# EAGLE design scale-slave (EAGLE 9.1.0)
DELETE: MF
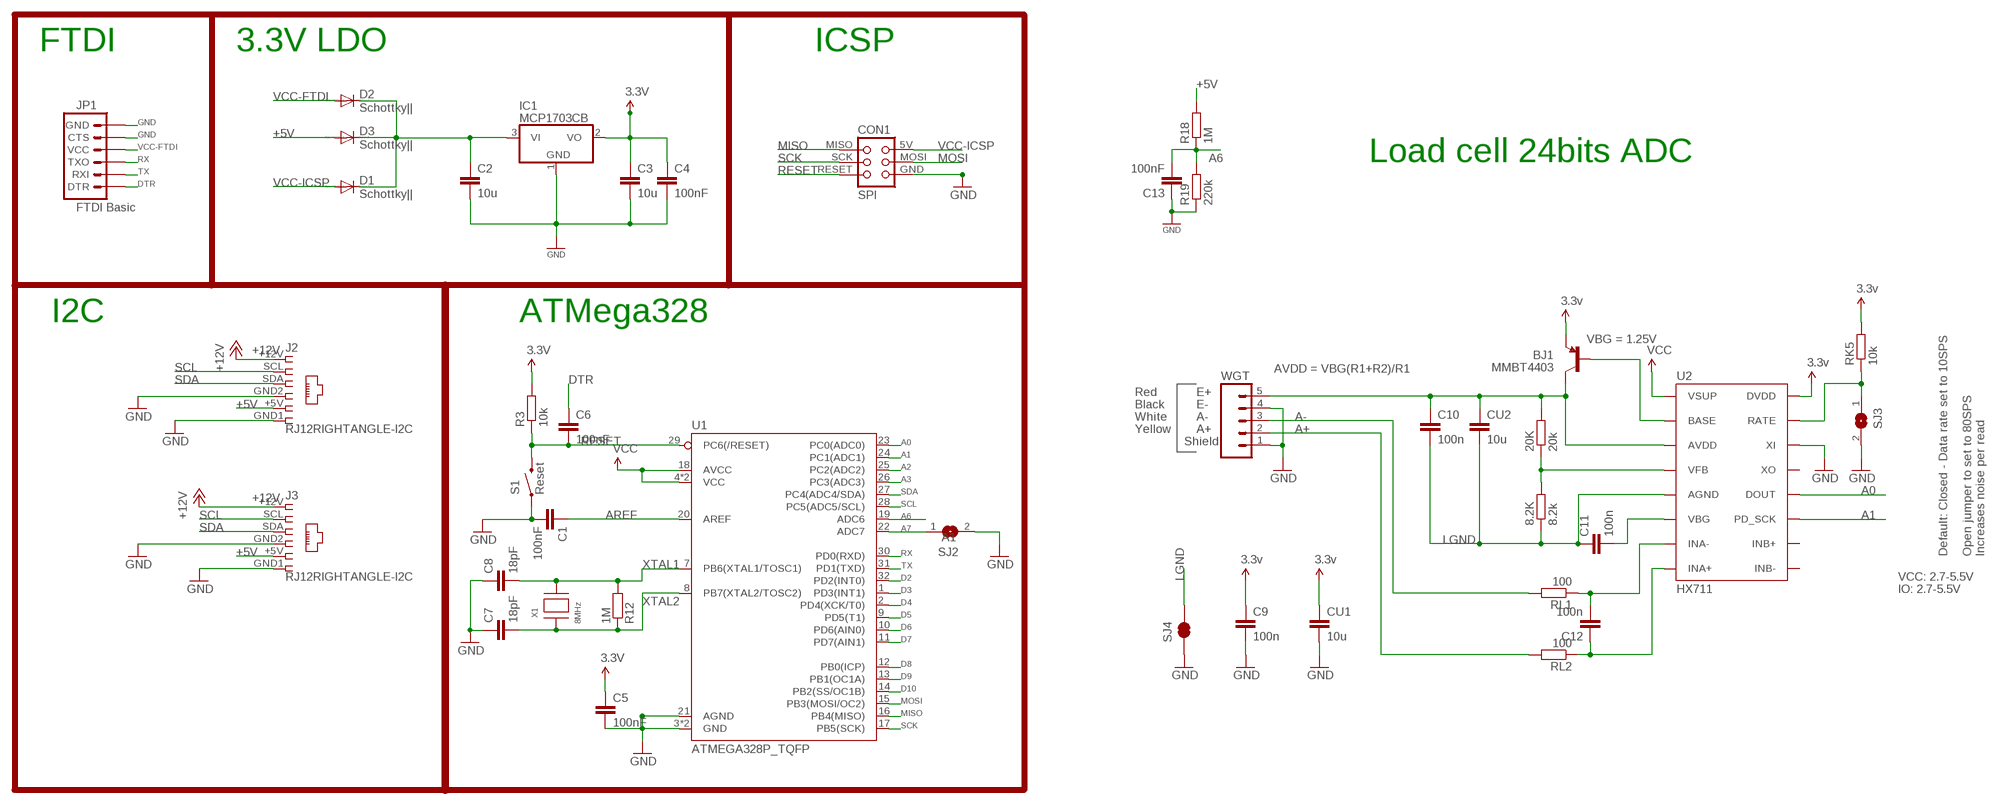
[diagram p0: schematic, sheet 1]

## Parts
8.2K  8.2k  R-EU_M0805  [M0805]
20K  20k  R-EU_M0805  [M0805]
BJ1  MMBT4403  TRANSISTOR_PNPMMBT4403  [SOT23-3]
C1  100nF  C-EUC0805K  [C0805K]
C2  10u  C-EUC0805K  [C0805K]
C3  10u  C-EUC0805K  [C0805K]
C4  100nF  C-EUC0805K  [C0805K]
C5  100nF  C-EUC0805K  [C0805K]
C6  100nF  C-EUC0805K  [C0805K]
C7  18pF  C-EUC0805K  [C0805K]
C8  18pF  C-EUC0805K  [C0805K]
C9  100n  C-EUC0805  [C0805]
C10  100n  C-EUC0805  [C0805]
C11  100n  C-EUC0805  [C0805]
C12  100n  C-EUC0805  [C0805]
C13  100nF  C-EUC0805K  [C0805K]
CON1  SPI  TINYISPTAG  [TC2030-MCP]
CU1  10u  C-EUC0805  [C0805]
CU2  10u  C-EUC0805  [C0805]
D1  Schottky||  MBR0520LT  [SOD123]
D2  Schottky||  MBR0520LT  [SOD123]
D3  Schottky||  MBR0520LT  [SOD123]
IC1  MCP1703CB  [SOT23]
J2  RJ12RIGHTANGLE-I2C  [RJ12-RIGHTANGLE-I2C]
J3  RJ12RIGHTANGLE-I2C  [RJ12-RIGHTANGLE-I2C]
JP1  FTDI Basic  ARDUINO_SERIAL_PROGRAMPTH  [1X06]
R3  10k  R-EU_R0805  [R0805]
R12  1M  R-EU_R0805  [R0805]
R18  1M  R-EU_R0805  [R0805]
R19  220k  R-EU_R0805  [R0805]
RK5  10k  R-EU_M0805  [M0805]
RL1  100  R-EU_M0805  [M0805]
RL2  100  R-EU_M0805  [M0805]
S1  Reset  SWITCH-MOMENTARY-2SMD-ALT01  [TACTILE-SWITCH-SMD-ALT01]
SJ2  A1  SJ  [SJ]
SJ3  SJ  [SJ]
SJ4  JUMPER-PAD-2-NC_BY_TRACE  [PAD-JUMPER-2-NC_BY_TRACE_YES_SILK]
U1  ATMEGA328P_TQFP  [TQFP32-08]
U2  HX711  HX711HX711  [SO16]
WGT  M05PTH  [1X05]
X1  8MHz  XTALNX6035  [NX6035]

## Nets
3.3V [power]: BJ1.2(E) C3.1 C4.1 C5.1 C9.1 CU1.1 IC1.2(VO) R3.2 RK5.2 U1.4(VCC) U1.6(VCC) U1.18(AVCC) U2.1(VSUP) U2.16(DVDD) ; supply symbol labelled 3.3v, VCC
+5V: D3.A J2.+5V J3.+5V R18.2
+12V [power]: J2.+12V J3.+12V
+XV: C2.1 D1.C D2.C D3.C IC1.3(VI)
A0: U1.23(PC0(ADC0)) U2.12(DOUT)
A1: U1.24(PC1(ADC1)) U2.11(PD_SCK)
A2: U1.25(PC2(ADC2))
A3: U1.26(PC3(ADC3))
A6: C13.2 R18.1 R19.2 U1.19(ADC6)
A7: SJ2.1 U1.22(ADC7)
A+: RL2.2 WGT.2
A-: RL1.2 WGT.3
AREF: C1.1 U1.20(AREF)
CN3: C11.2 U2.6(VBG)
D2: U1.32(PD2(INT0))
D3: U1.1(PD3(INT1))
D4: U1.2(PD4(XCK/T0))
D5: U1.9(PD5(T1))
D6: U1.10(PD6(AIN0))
D7: U1.11(PD7(AIN1))
D8: U1.12(PB0(ICP))
D9: U1.13(PB1(OC1A))
D10: U1.14(PB2(SS/OC1B))
DTR: C6.1 JP1.1(DTR)
GND [power]: C1.2 C2.2 C3.2 C4.2 C5.2 C7.1 C8.1 C9.2 C13.1 CON1.GND CU1.2 IC1.1(GND) J2.GND1 J2.GND2 J3.GND1 J3.GND2 JP1.5(CTS) JP1.6(GND) R19.1 S1.1 S1.2 SJ2.2 SJ3.2 SJ4.1 U1.3(GND) U1.5(GND) U1.21(AGND) U2.14(XI) WGT.1 WGT.4
LGND: 8.2K.1 C10.2 C11.1 CU2.2 SJ4.2 U2.5(AGND)
MISO: CON1.MISO U1.16(PB4(MISO))
MOSI: CON1.MOSI U1.15(PB3(MOSI/OC2))
N$5: 20K.2 BJ1.3(C) C10.1 CU2.1 U2.3(AVDD) WGT.5
N$20: C12.2 RL1.1 U2.7(INA-)
N$38: BJ1.1(B) U2.2(BASE)
N$39: 8.2K.2 20K.1 U2.4(VFB)
N$41: RK5.1 SJ3.1 U2.15(RATE)
N$43: C12.1 RL2.1 U2.8(INA+)
RESET: C6.2 CON1.RESET R3.1 S1.3 S1.4 U1.29(PC6(/RESET))
RX: JP1.3(TXO) U1.30(PD0(RXD))
SCK: CON1.SCK U1.17(PB5(SCK))
SCL: J2.SCL J3.SCL U1.28(PC5(ADC5/SCL))
SDA: J2.SDA J3.SDA U1.27(PC4(ADC4/SDA))
TX: JP1.2(RXI) U1.31(PD1(TXD))
VCC-FTDI: D2.A JP1.4(VCC)
VCC-ICSP: CON1.5V(VCC) D1.A
XTAL1: C8.2 R12.2 U1.7(PB6(XTAL1/TOSC1)) X1.P$2
XTAL2: C7.2 R12.1 U1.8(PB7(XTAL2/TOSC2)) X1.P$1
Unconnected: U2.9(INB-) U2.10(INB+) U2.13(XO)

## Notes on the sheet
- FTDI | 3.3V LDO | ICSP
- Load cell 24bits ADC
- I2C | ATMega328
- VBG = 1.25V
- AVDD = VBG(R1+R2)/R1
- Red | E+
- Black | E-
- White | A-
- Yellow | A+
- Shield
- Default: Closed - Data rate set to 10SPS
- Open jumper to set to 80SPS
  Increases noise per read
- VCC: 2.7-5.5V
- IO: 2.7-5.5V

## Library data of the parts
8.2K 20K RK5 RL1 RL2 = resistor:R-EU_: RESISTOR, European symbol
BJ1 = SparkFun-DiscreteSemi:TRANSISTOR_PNP: Generic PNP BJT Double check pinouts against datasheets- not all devices are the same! MMBT3906 - 40V 200mA SOT-23 (TRANS-08052) MMBT4403 - 40V 600mA SOT-23 (TRANS-09245); PROD_ID: TRANS-09245
C1 C4-C6 C13 = rcl:C-EU: CAPACITOR, European symbol; ELECROW: C49678; LCSC: C49678; MPN: 80-C1206C104K5R
C2 C3 = rcl:C-EU: CAPACITOR, European symbol; ELECROW: C15850; LCSC: C15850; MPN: 77-VJ1206V106ZXQTBC
C7 C8 = rcl:C-EU: CAPACITOR, European symbol; ELECROW: C1797; LCSC: C1797; MPN: 77-VJ1206A180JXXPBC
C9-C12 CU1 CU2 = rcl:C-EU: CAPACITOR, European symbol
CON1 = lpatiny:TINYISP: CONNECTOR
D1-D3 = diode:MBR0520LT: SCHOTTKY BARRIER RECTIFIER Source: http://onsemi.com .. MBR0520LT1-D.pdf; LCSC: C82544; MPN: 621-1N5819HW-F
IC1 = linear:MCP1703: 250 mA, 16V, Low Quiescent Current LDO Regulator Source: http://ww1.microchip.com/downloads/en/DeviceDoc/22049b.pdf; LCSC: C53352
J2 J3 = lpatiny:RJ12: CORCOM Modular RJ Jacks No Shield Source: www.tycoelectronics.com .. ENG_DS_1654001_1099_RJ_L_0507.pdf
JP1 = SparkFun:ARDUINO_SERIAL_PROGRAM
R3 = rcl:R-EU_: RESISTOR, European symbol; ELECROW: C17513; LCSC: C17513
R12 R18 R19 = rcl:R-EU_: RESISTOR, European symbol; ELECROW: C17514; LCSC: C17514
S1 = Testing:SWITCH-MOMENTARY-2: Various NO switches- pushbuttons, reed, etc
SJ2 SJ3 = jumper:SJ: SMD solder JUMPER
SJ4 = SparkFun-Passives:JUMPER-PAD-2-NC_BY_TRACE
U1 = SparkFun-IC-Microcontroller:ATMEGA328P_TQFP: Popular 328P in QFP Storefront component: ATmega328 - TQFP <https://www.sparkfun.com/products/13448> (COM-13448) Datasheet <http://www.sparkfun.com/datasheets/Components/SMD/ATMega328.pdf> SparkFun Products SparkFun RedBoard - Programmed with Arduino <https://www.sparkfun.com/products/12757> (DEV-12757) Arduino Pro Mini 328 - 5V/16MHz <https://www.sparkfun.com/products/11113> (DEV-11113) Arduino Pro Mini 328 - 3.3V/8MHz <https://www.sparkfun.com/products/11114> (DEV-11114) SparkFun OpenLog <https://www.sparkfun.com/products/13712> (DEV-13712) SparkFun MicroView - OLED Arduino Module <https://www.sparkfun.com/products/12923> (DEV-12923) SparkFun Digital Sandbox <https://www.sparkfun.com/products/12651> (DEV-12651) SparkFun PicoBoard <https://www.sparkfun.com/products/11888> (WIG-11888) Arduino Fio <https://www.sparkfun.com/products/10116> (DEV-10116) LilyPad Arduino 328 Main Board <https://www.sparkfun.com/products/13342> (DEV-13342) SparkFun RedStick <https://www.sparkfun.com/products/13741> (DEV-13741) LilyPad MP3 <https://www.sparkfun.com/products/11013> (DEV-11013) LilyPad Arduino SimpleSnap <https://www.sparkfun.com/products/10941> (DEV-10941) SparkFun Stepoko <https://www.sparkfun.com/products/13899> (ROB-13899) SparkFun Geiger Counter <https://www.sparkfun.com/products/11345> (SEN-11345) SparkFun EL Sequencer <https://www.sparkfun.com/products/12781> (COM-12781) Arduino Pro 328 - 5V/16MHz <https://www.sparkfun.com/products/10915> (DEV-10915) CryptoCape <https://www.sparkfun.com/products/12773> (DEV-12773) SparkFun IR Thermometer Evaluation Board - MLX90614 <https://www.sparkfun.com/products/10740> (SEN-10740) SparkFun RedBot Mainboard <https://www.sparkfun.com/products/12097> (ROB-12097) Arduino Pro 328 - 3.3V/8MHz <https://www.sparkfun.com/products/10914> (DEV-10914) SparkFun Block for Intel® Edison - Arduino <https://www.sparkfun.com/products/13036> (DEV-13036) SparkFun Simon Says - Surface Mount Soldering Kit <https://www.sparkfun.com/products/10935> (KIT-10935) SparkFun 7-Segment Serial Display - Red <https://www.sparkfun.com/products/11441> (COM-11441) SparkFun 7-Segment Serial Display - White <https://www.sparkfun.com/products/11629> (COM-11629) SparkFun 7-Segment Serial Display - Yellow <https://www.sparkfun.com/products/11443> (COM-11443) SparkFun 7-Segment Serial Display - Kelly Green <https://www.sparkfun.com/products/11440> (COM-11440) SparkFun 7-Segment Serial Display - Blue <https://www.sparkfun.com/products/11442> (COM-11442) SparkFun OpenSegment Serial Display - 20mm (Blue) <https://www.sparkfun.com/products/11647> (COM-11647) SparkFun OpenSegment Serial Display - 20mm (Green) <https://www.sparkfun.com/products/11646> (COM-11646) SparkFun OpenSegment Serial Display - 20mm (White) <https://www.sparkfun.com/products/11648> (COM-11648) SparkFun OpenSegment Serial Display - 20mm (Red) <https://www.sparkfun.com/products/11644> (COM-11644) SparkFun OpenSegment Serial Display - 20mm (Yellow) <https://www.sparkfun.com/products/11645> (COM-11645) SparkFun OpenSegment Shield <https://www.sparkfun.com/products/13190> (DEV-13190); PROD_ID: IC-09069
U2 = Testing:HX711; PROD_ID: IC-12445
WGT = SparkFun-Connectors:M05: Header 5 Standard 5-pin 0.1" header. Use with straight break away headers (SKU : PRT-00116), right angle break away headers (PRT-00553), swiss pins (PRT-00743), machine pins (PRT-00117), and female headers (PRT-00115). Molex polarized connector foot print use with SKU : PRT-08230 with associated crimp pins and housings.
X1 = lpatiny:XTAL: Low cost SMT crystals, no capacitors included http://www.ladyada.net/library/eagle; LCSC: C122522; MPN: 729-F60800010

## Net classes
0 default: width 0.254 mm, clearance 0.25 mm
1 power: width 0.254 mm, drill 0.305 mm, clearance 0.25 mm
2 VIN: width 0.406 mm, clearance 0.25 mm
3 fine: width 0.406 mm, clearance 0.25 mm
4 aref: width 0.406 mm, clearance 0.25 mm

## Board
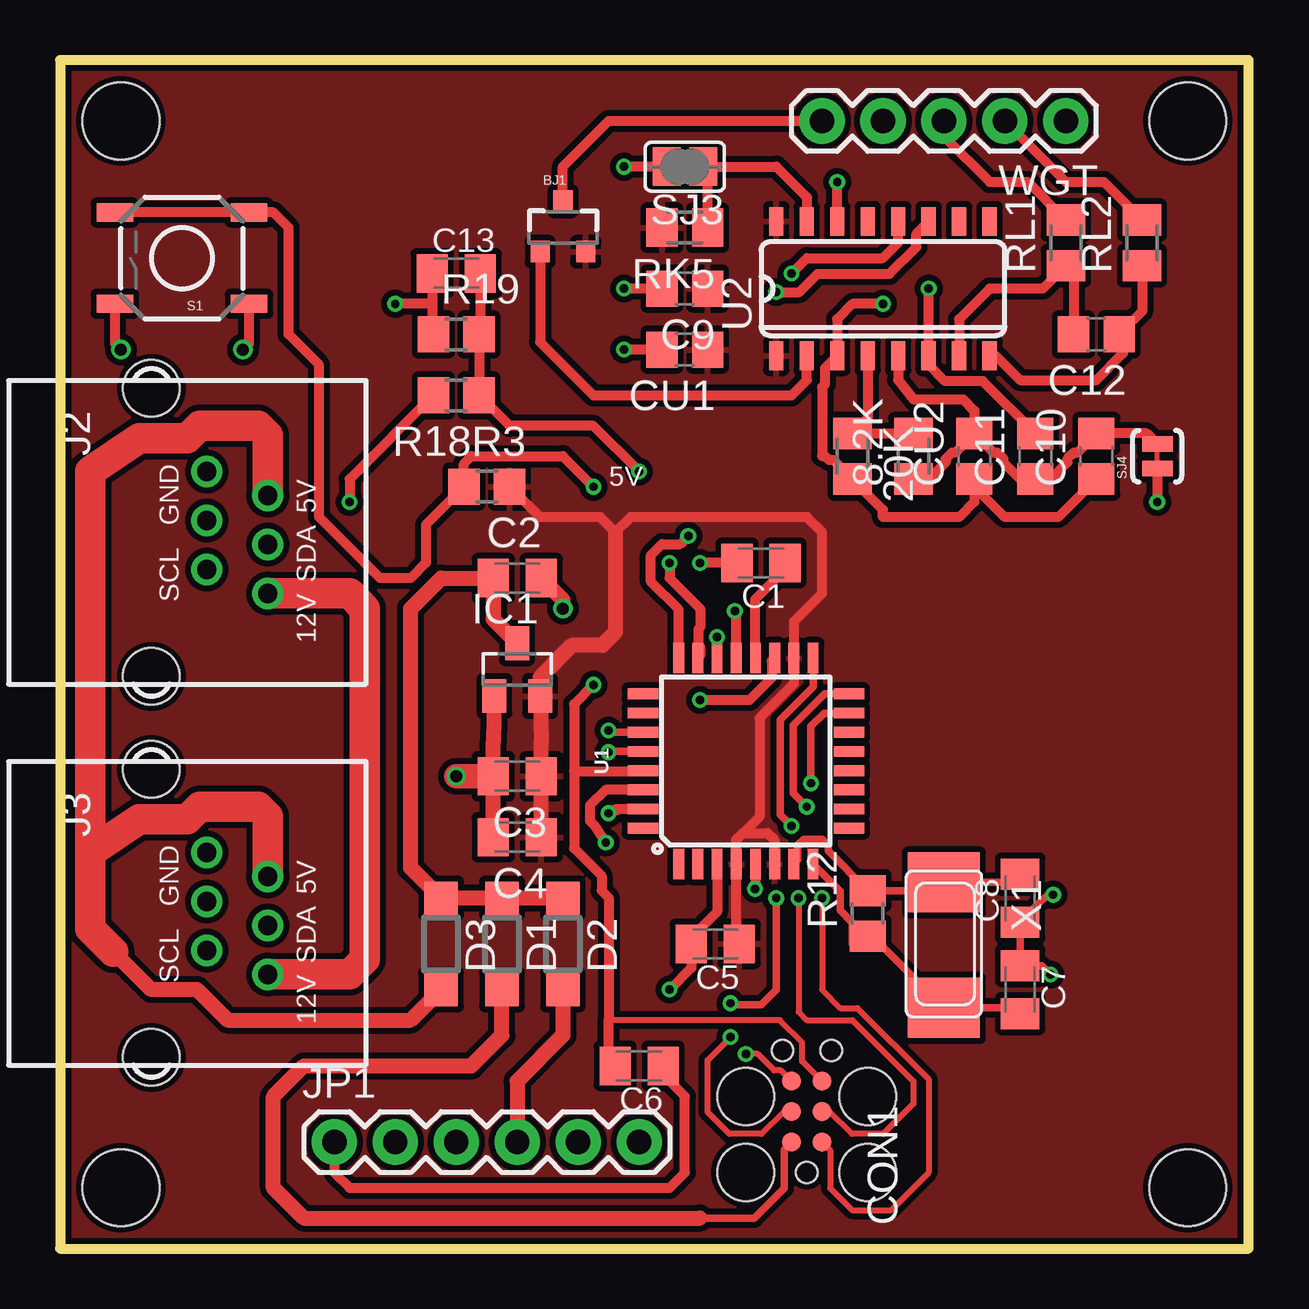
[diagram p1: board, top side]
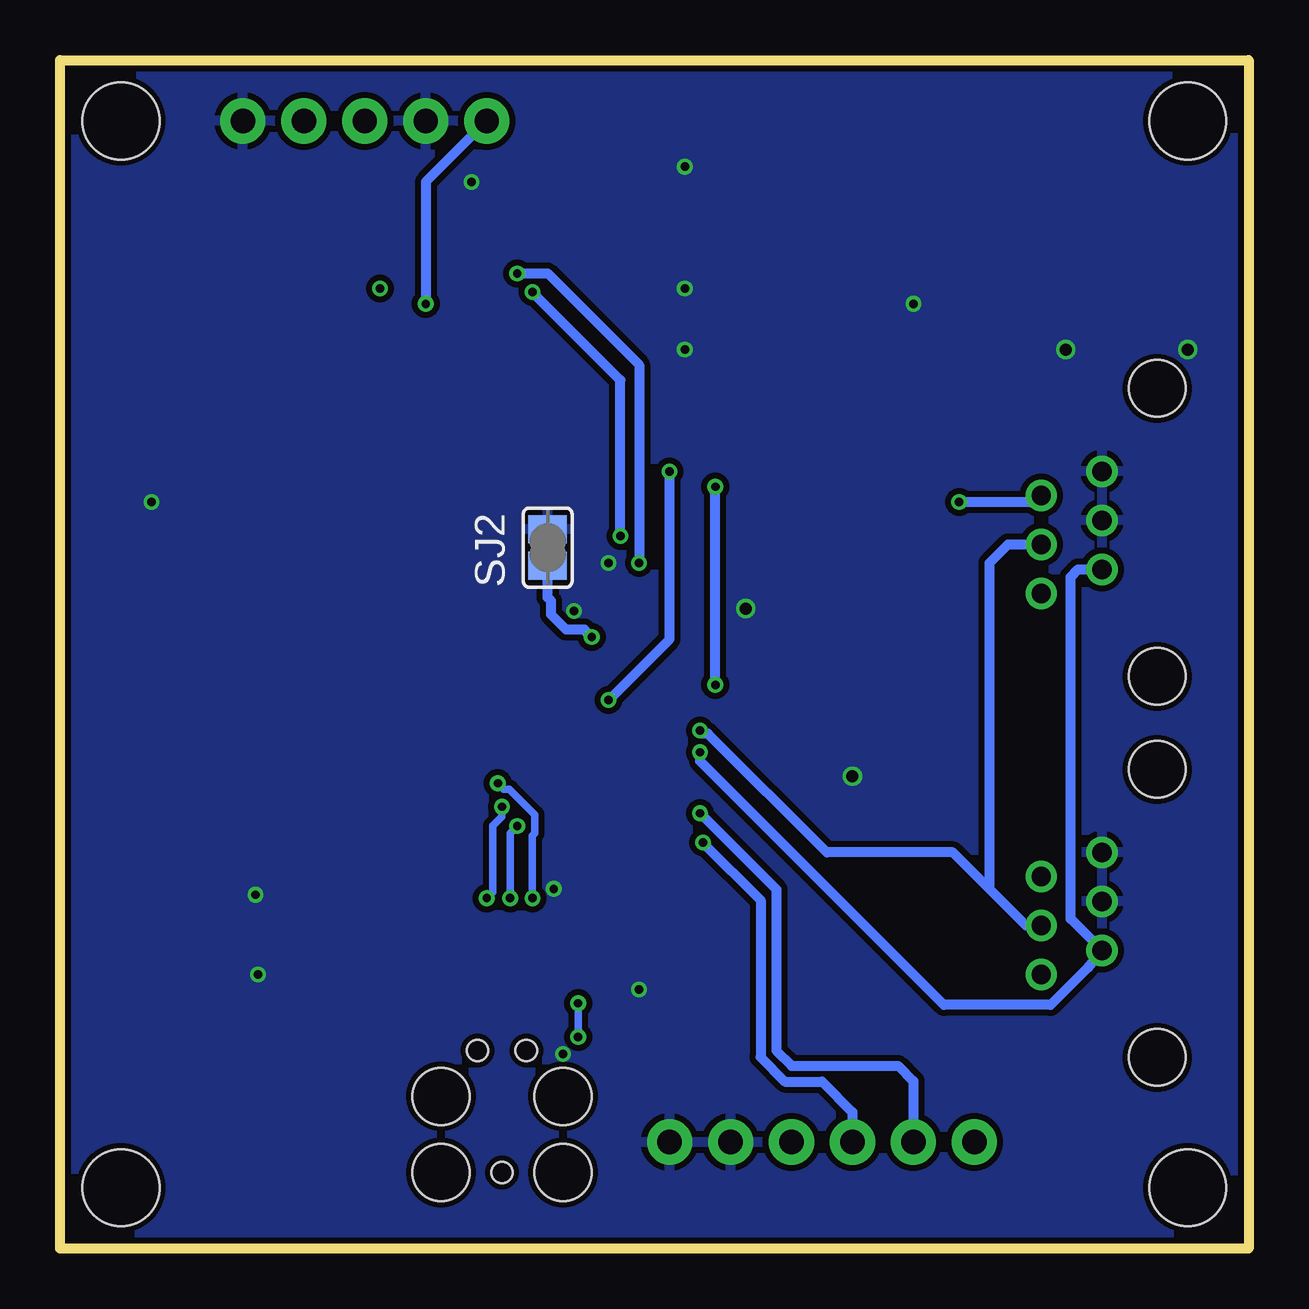
[diagram p2: board, bottom side, seen from below]

Size 49.53 x 49.53 mm. Coordinates in mm from the lower left corner, seen from the top.
Outline: 0,0 49.53,0 49.53,49.53 0,49.53 0,0
Copper layers (1*16): Top 0.035mm / dielectric 0.2mm / Bottom 0.035mm
Design rules "SeeedStudio_DRU_no_angle_20130527 *": minimum track width 8mil, minimum drill 12mil, track to track 6mil, track to pad 6mil, pad to pad 6mil, via to via 6mil, smd to smd 0mil, copper to edge 10mil, drill to drill 10mil, minimum pad ring 6mil, minimum via ring 6mil, stop-mask expansion 2mil, vias tented up to drill 25mil, thermal gap 10mil
Holes 3.2 mm at 2.54,46.99 46.99,46.99 46.99,2.54 2.54,2.54

### Footprints (pad centres in the part's own frame; a part is rotated, then mirrored left to right if it is on the bottom)
M0805 = smd 1.3 x 1.6: 1 -0.95,0; 2 0.95,0
SOT23-3 = smd 0.8 x 0.9: 1 -0.95,-1; 2 0.95,-1; 3 0,1.1
C0805K = smd 1.3 x 1.6: 1 -1,0; 2 1,0
C0805 = smd 1.3 x 1.5: 1 -0.95,0; 2 0.95,0
TC2030-MCP = smd 0.787 x 0.787: 5V 1.27,0.635; GND 3.81,0.635; MISO 1.27,-0.635; MOSI 2.54,0.635; RESET 3.81,-0.635; SCK 2.54,-0.635 | hole 0.889: 0,0; 5.08,-1.016; 5.08,1.016 | hole 2.375: 0,2.54; 0,-2.54; 3.175,-2.54; 3.175,2.54
SOD123 = smd 1.4 x 1.4: A 1.9,0; C -1.9,0
SOT23 = smd 1 x 1.4: 1 -0.95,-1.1; 2 0.95,-1.1; 3 0,1.1
RJ12-RIGHTANGLE-I2C = drill 0.8 pad 1.3: +5V -1.54,4.84; +12V 2.54,4.84; GND1 -2.54,2.3; GND2 -0.5,2.3; SCL 1.54,2.3; SDA 0.5,4.84 | hole 2.36: -6,0; 6,0
1X06 = drill 1.016 pad 1.88: 1 0,0; 2 2.54,0; 3 5.08,0; 4 7.62,0; 5 10.16,0; 6 12.7,0
R0805 = smd 1.3 x 1.5: 1 -0.95,0; 2 0.95,0
TACTILE-SWITCH-SMD-ALT01 = smd 1.524 x 0.762: 1 -2.794,1.905; 2 2.794,1.905; 3 -2.794,-1.905; 4 2.794,-1.905
SJ = smd 1.168 x 1.6: 1 -0.762,0; 2 0.762,0
PAD-JUMPER-2-NC_BY_TRACE_YES_SILK = smd 0.635 x 1.27: 1 -0.508,0; 2 0.508,0
TQFP32-08 = smd 1.27 x 0.45: 1 -4.293,2.8; 2 -4.293,2; 3 -4.293,1.2; 4 -4.293,0.4; 5 -4.293,-0.4; 6 -4.293,-1.2; 7 -4.293,-2; 8 -4.293,-2.8; 17 4.293,-2.8; 18 4.293,-2; 19 4.293,-1.2; 20 4.293,-0.4; 21 4.293,0.4; 22 4.293,1.2; 23 4.293,2; 24 4.293,2.8 | smd 0.45 x 1.27: 9 -2.8,-4.293; 10 -2,-4.293; 11 -1.2,-4.293; 12 -0.4,-4.293; 13 0.4,-4.293; 14 1.2,-4.293; 15 2,-4.293; 16 2.8,-4.293; 25 2.8,4.293; 26 2,4.293; 27 1.2,4.293; 28 0.4,4.293; 29 -0.4,4.293; 30 -1.2,4.293; 31 -2,4.293; 32 -2.8,4.293
SO16 = smd 0.6 x 1.2: 1 -4.445,-2.8; 2 -3.175,-2.8; 3 -1.905,-2.8; 4 -0.635,-2.8; 5 0.635,-2.8; 6 1.905,-2.8; 7 3.175,-2.8; 8 4.445,-2.8; 9 4.445,2.8; 10 3.175,2.8; 11 1.905,2.8; 12 0.635,2.8; 13 -0.635,2.8; 14 -1.905,2.8; 15 -3.175,2.8; 16 -4.445,2.8
1X05 = drill 1.016 pad 1.88: 1 0,0; 2 2.54,0; 3 5.08,0; 4 7.62,0; 5 10.16,0
NX6035 = smd 2.5 x 3: P$1 2.665,0; P$2 -2.565,0

### Placement (x,y rotation side)
8.2K  35.56,33.02 90 top
20K  33.02,33.02 270 top
BJ1  20.95,42.55 0 top
C1  29.21,28.57 180 top
C2  19.05,27.94 0 top
C3  19.05,19.68 180 top
C4  19.05,17.14 180 top
C5  27.3,12.7 180 top
C6  24.13,7.62 180 top
C7  40.01,10.79 270 top
C8  40.01,14.61 90 top
C9  26.04,40.01 180 top
C10  43.18,33.02 90 top
C11  40.64,33.02 90 top
C12  43.18,38.1 180 top
C13  16.51,40.64 0 top
CON1  31.11,3.17 90 top
CU1  26.04,37.47 180 top
CU2  38.1,33.02 90 top
D1  18.41,12.7 270 top
D2  20.95,12.7 270 top
D3  15.88,12.7 270 top
IC1  19.05,24.13 0 top
J2  3.81,29.84 270 top
J3  3.81,13.97 270 top
JP1  11.43,4.45 0 top
R3  17.78,31.75 0 top
R12  33.66,13.97 90 top
R18  16.51,35.56 180 top
R19  16.51,38.1 0 top
RK5  26.04,42.55 180 top
RL1  41.91,41.91 90 top
RL2  45.09,41.91 90 top
S1  5.08,41.27 180 top
SJ2  29.21,29.21 90 bottom
SJ3  26.04,45.09 180 top
SJ4  45.72,33.02 90 top
U1  28.57,20.32 90 top
U2  34.29,40.01 0 top
WGT  41.91,46.99 180 top
X1  36.83,12.7 270 top

### Tracks (layer width: path | path; a pad name or v marks a point on that pad's centre or on a via)
3.3V
  Top 0.406: C5.1 28.18,12.83 U1.4 28.18,17.03 28.46,17.32 | U1.6 29.77,17.03 29.49,17.32 28.46,17.32 | 28.46,17.32 29.15,18 29.15,22.12 30.57,23.55 U1.18 30.57,26.13 31.75,27.3 31.75,29.84 31.11,30.48 23.78,30.48 23.15,29.84 22.51,30.48 20,30.48 R3.2
  Top 0.635: C4.1 C3.1 20.05,21.07 IC1.2 20,23.81 21.33,25.14 22.6,25.14 23.15,25.69 23.15,29.84
  pour Top: 0,49.53 49.53,49.53 49.53,0 0,0
+5V  (via drill 0.35)
  Top 0.406: R18.2 12.06,32.06 v12.06,31.11
  Top 0.635: 2.22,12.38 3.81,10.79 5.71,10.79 6.98,9.53 14.61,9.53 D3.A
  Top 1.27: J2.+5V 8.65,33.9 8.26,34.29 5.82,34.29 5.3,33.78 3.3,33.78 1.27,32.38 1.27,16.51 | 1.27,16.51 1.27,13.34 2.22,12.38 | J3.+5V 8.65,18.02 8.26,18.41 5.82,18.41 5.3,17.9 3.3,17.9 1.27,16.51
  Bottom 0.406: v12.06,31.11 8.92,31.11 J2.+5V
+12V
  Top 1.27: J3.+12V 12.06,11.43 12.7,12.06 12.7,26.67 12.06,27.3 J2.+12V
+XV
  Top 0.635: D2.C D1.C D3.C 14.61,15.87 14.61,26.67 15.88,27.94 C2.1 18.05,26.23 IC1.3
A0  (via drill 0.35)
  Top 0.406: v25.4,28.57 25.4,27.94 26.67,26.67 26.67,25.89 26.59,25.81 26.59,25.17 26.67,25.09 26.67,24.71 U1.23 | v30.48,40.64 31.11,41.27 34.29,41.27 34.92,41.91 U2.12
  Bottom 0.406: v30.48,40.64 29.21,40.64 25.4,36.83 v25.4,28.57
A1  (via drill 0.35)
  Top 0.406: U1.24 25.77,26.64 24.62,27.79 24.62,28.9 25.08,29.36 25.84,29.36 v26.18,29.7 | U2.11 35.68,42.29 35.68,41.73 34.56,40.62 31.56,40.62 30.8,39.86 v29.84,39.86
  Bottom 0.406: v26.18,29.7 26.18,36.2 v29.84,39.86
A6  (via drill 0.35)
  Top 0.406: C13.2 17.51,38.15 R19.2 R18.1 18.73,34.29 22.23,34.29 v24.13,32.38 | U1.19 29.65,24.49 29.65,23.79 28.72,22.86 v26.67,22.86
  Bottom 0.406: v26.67,22.86 24.13,25.4 v24.13,32.38
A7  (via drill 0.35)
  Top 0.406: U1.22 v27.38,25.49
  Bottom 0.406: v27.38,25.49 27.68,25.79 28.44,25.79 29.06,26.42 29.06,26.99 29.21,27.14 SJ2.1
A+
  Top 0.406: WGT.2 41.91,44.45 43.49,44.45 RL2.2
A-
  Top 0.406: WGT.3 36.83,46.35 38.73,44.45 40.32,44.45 RL1.2
AREF
  Top 0.406: C1.1 30.21,28.3 28.98,27.07 U1.20
CN3  (via drill 0.35)
  Top 0.406: v36.2,40.01 U2.6 36.2,36.83 36.87,36.15 38.46,36.15 C11.2
DTR
  Top 0.406: JP1.1 11.43,3.17 12.06,2.54 25.4,2.54 26.04,3.17 26.04,6.35 25.13,7.25 C6.1
GND  (via drill 0.35, 0.5)
  Top 0.254: CON1.GND 30.04,7.43 29.76,7.43 29.07,8.12 v28.57,8.12
  Top 0.305: v41.27,11.43 40.91,11.79 C7.1 C8.1 40.95,14.55 40.97,14.55 41.17,14.75 v41.38,14.75
  Top 0.406: U1.3 27.38,14.04 26.67,13.34 26.67,13.06 C5.2 26.3,11.7 v25.4,10.79 | U1.21 28.18,26.35 28.12,26.4 v28.12,26.57 | U1.5 28.98,15.02 v28.96,14.99 | C1.2 v26.67,28.57 | S1.1 7.87,37.72 v7.62,37.47 | S1.2 2.29,37.72 v2.54,37.47 | SJ4.1 v45.72,31.11 | U2.14 v32.38,44.45 | SJ3.2 v23.5,45.09 | C9.2 v23.5,40.01 | CU1.2 v23.5,37.47 | C13.1 15.51,39.37 | 15.51,39.37 15.51,38.15 R19.1 | 15.51,39.37 v13.97,39.37
  Top 0.635: IC1.1 18.05,21.07 C3.2 C4.2 | C2.2 20.95,27.04 v20.95,26.67
  Top 1.016: C3.2 v16.51,19.68
  pour Bottom: 0,49.53 0,0 49.53,0 49.53,49.53
LGND
  Top 0.406: U2.5 34.92,36.2 35.56,35.39 37.64,35.39 38.1,34.92 CU2.2 | 8.2K.1 36.2,32.07 36.9,32.77 36.9,32.91 37.16,33.17 37.3,33.17 CU2.2 | SJ4.2 45.28,33.97 C10.2 42.38,33.17 42.24,33.17 41.98,32.91 41.98,32.77 41.28,32.07 C11.1 40,32.07 39.3,32.77 39.3,32.91 39.04,33.17 38.9,33.17 CU2.2
MISO  (via drill 0.35)
  Top 0.254: CON1.MISO 32.09,4.11 32.09,2.52 33.01,1.61 34.63,1.61 36.2,3.17 36.2,7.06 33.23,10.03 32.52,10.03 31.75,10.79 v31.75,14.61
  Top 0.305: v31.11,18.41 30.56,18.97 30.56,21.82 31.86,23.12 U1.16
  Bottom 0.305: v31.11,18.41 31.11,18.01 31.5,17.62 31.5,14.85 v31.75,14.61
MOSI  (via drill 0.35)
  Top 0.254: CON1.MOSI 30.16,5.71 29.23,4.78 27.89,4.78 26.98,5.69 26.98,7.86 v27.94,8.82
  Top 0.305: v31.29,19.39 31.29,21.76 31.84,22.32 U1.15 | v29.84,14.61 29.84,10.79 29.21,10.16 28.01,10.16 v27.94,10.23
  Bottom 0.305: v31.29,19.39 31.04,19.14 30.81,19.14 29.75,18.08 29.75,17.31 29.84,17.21 v29.84,14.61 | v27.94,10.23 v27.94,8.82
N$5  (via drill 0.35)
  Top 0.406: C10.1 41.59,30.48 39.37,30.48 38.1,31.75 CU2.1 38.1,31.11 37.47,30.48 34.29,30.48 34.29,30.8 20K.2 32.22,32.87 32.03,32.87 31.88,33.02 31.75,33.02 31.75,35.9 31.87,36.02 31.87,36.69 U2.3 32.38,38.73 33.02,39.37 v34.29,39.37 | BJ1.3 20.95,45.09 22.86,46.99 WGT.5
  Bottom 0.406: WGT.5 34.29,44.45 v34.29,39.37
N$20
  Top 0.406: C12.2 42.23,40.64 RL1.1 40.95,40.01 38.73,40.01 37.47,38.73 U2.7
N$38
  Top 0.406: BJ1.1 20,37.78 22.23,35.56 30.48,35.56 31.11,36.2 U2.2
N$39
  Top 0.406: U2.4 33.66,34.6 20K.1 8.2K.2
N$41
  Top 0.406: RK5.1 26.98,44.9 SJ3.1 29.84,45.09 31.11,43.81 U2.15
N$43
  Top 0.406: RL2.1 45.09,39.05 44.29,38.26 | 44.29,38.26 C12.1 | U2.8 38.99,37.2 40.01,36.2 43.18,36.2 44.29,37.3 44.29,38.26
RESET  (via drill 0.35)
  Top 0.254: CON1.RESET 30.92,7.81 30.92,8.6 30,9.53 22.86,9.53
  Top 0.406: U1.29 24.27,19.91 21.42,19.91 | C6.2 22.86,7.89 22.86,9.53 22.86,14.62 22.57,14.92 22.57,15.53 21.42,16.68 21.42,19.91 | v22.23,23.5 21.42,22.69 21.42,19.91 | S1.4 S1.3 8.89,43.18 9.53,42.55 9.53,38.1 10.79,36.83 10.79,30.48 13.34,27.94 14.61,27.94 15.24,28.57 15.24,30.16 R3.1 16.83,32.7 17.14,33.02 20.95,33.02 v22.23,31.75
  Bottom 0.406: v22.23,23.5 v22.23,31.75
RX  (via drill 0.35)
  Top 0.406: v22.74,16.92 22.28,17.62 22.08,17.82 22.08,18.47 22.73,19.12 U1.30
  Bottom 0.406: v22.74,16.92 20.34,14.52 20.34,7.98 19.32,6.96 17.78,6.96 16.51,5.69 JP1.3
SCK  (via drill 0.35)
  Top 0.254: CON1.SCK 32.07,5.71 33.01,4.78 34.3,4.78 35.56,6.04 35.56,6.99 33.02,9.53 31.11,9.53 30.77,9.87 v30.77,14.61
  Top 0.305: v30.48,17.61 30,18.09 30,22.05 31.38,23.42 U1.17
  Bottom 0.305: v30.48,17.61 30.77,17.32 v30.77,14.61
SCL  (via drill 0.35)
  Top 0.305: U1.28 22.86,20.72 v22.86,20.68
  Bottom 0.406: J2.SCL 7.12,28.3 7.42,28 7.42,13.74 J3.SCL 6.75,11.67 8.26,10.16 12.7,10.16 22.86,20.32 v22.86,20.68
SDA  (via drill 0.35)
  Top 0.305: U1.27 22.93,21.52
  Top 0.406: 22.93,21.52 v22.86,21.59
  Bottom 0.406: J2.SDA 10.03,29.34 10.79,28.57 10.79,14.98 | v22.86,21.59 22.74,21.47 22.54,21.47 17.58,16.51 12.32,16.51 10.79,14.98 | J3.SDA 9.29,13.47 10.79,14.98
TX  (via drill 0.35)
  Top 0.406: v22.86,18.14 22.98,18.27 23.18,18.27 23.18,18.32 U1.31
  Bottom 0.406: v22.86,18.14 19.68,14.97 19.68,8.26 19.05,7.62 14.61,7.62 13.97,6.99 JP1.2
VCC-FTDI
  Top 0.635: D2.A 20.95,8.89 19.05,6.99 JP1.4
VCC-ICSP
  Top 0.305: CON1.5V 30.17,4.13 30.17,2.52 28.92,1.27 26.67,1.27
  Top 0.635: 26.67,1.27 10.16,1.27 8.89,2.54 8.89,6.35 10.16,7.62 17.14,7.62 18.41,8.89 D1.A
XTAL1
  Top 0.305: U1.7 30.75,16.2 30.75,16.83 30.98,17.07 31.77,17.07 32,16.83 32,16.57 R12.2 36.48,14.92 X1.P$2 39.66,15.27 C8.2
XTAL2
  Top 0.305: U1.8 32.5,14.9 32.5,14.1 33.02,13.59 33.02,12.7 33.34,12.7 R12.1 33.84,13.02 X1.P$1 39.77,10.04 C7.2

### Text on the board
tNames: 5V
tValues: Slave I2C - Weight V1.0.1
bValues: Slave I2C - Weight V1.0.1 | A1 | A0